# Altium project ST1-1.PrjPcb (part 2 of 5)

## Sheet User_Interface.SchDoc: User Interface
size A3; DocumentNumber: 12; SheetNumber: 13; SheetTotal: 20
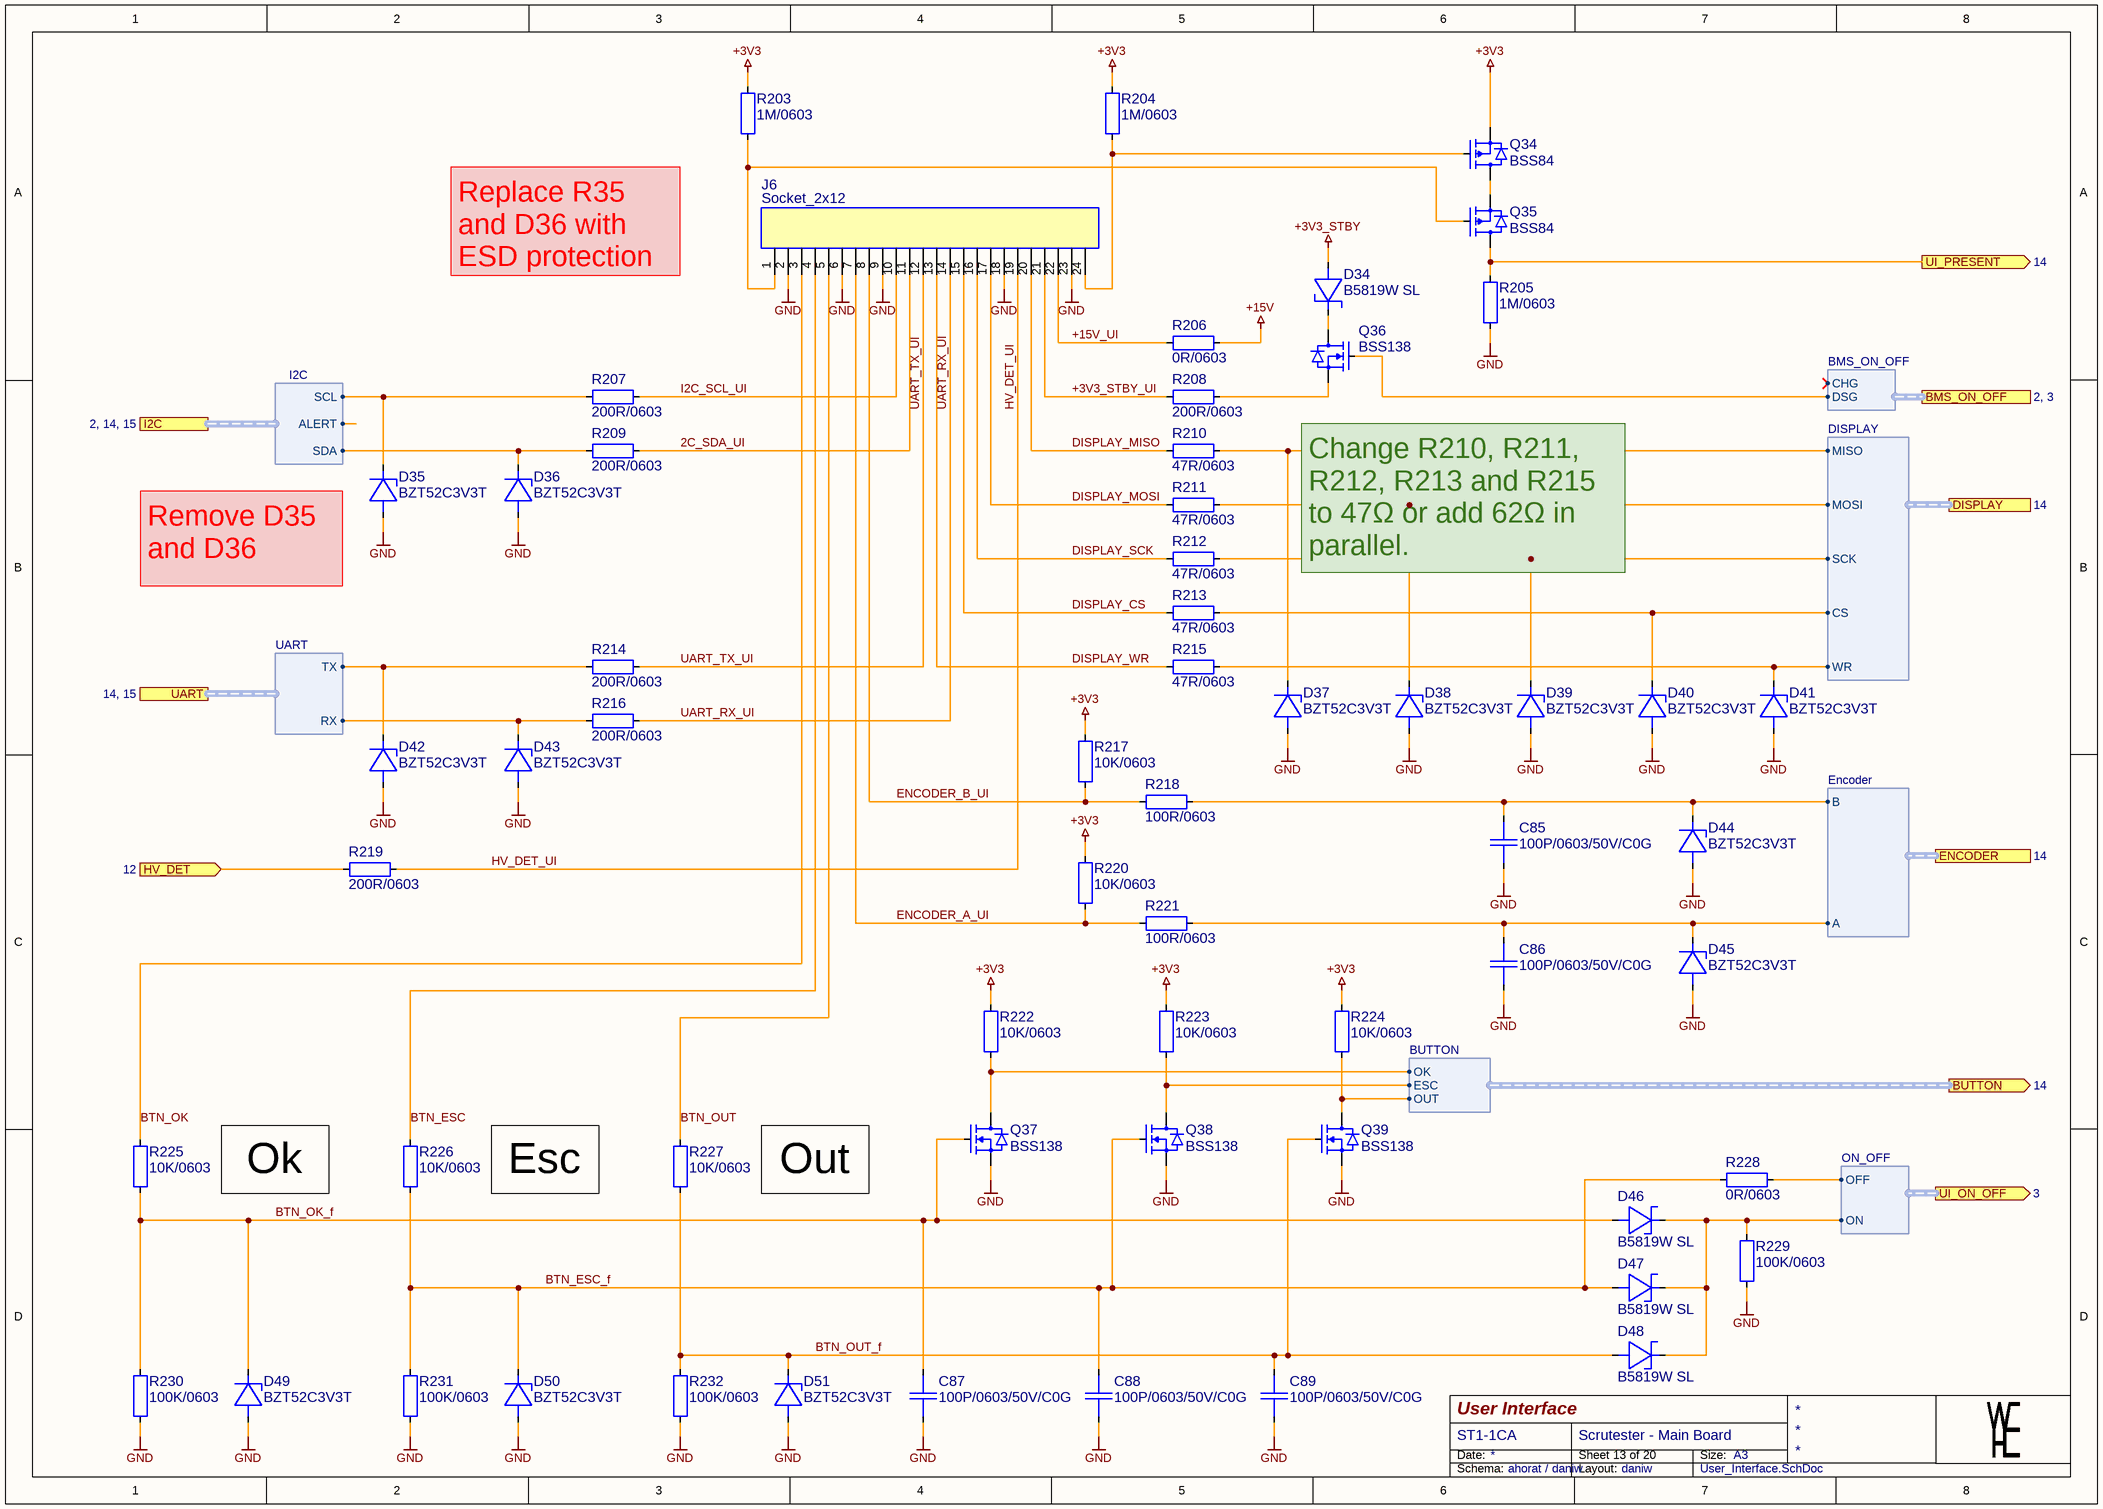
[diagram p3: User_Interface.SchDoc]

### Parts
C85  100P/0603/50V/C0G  [CAP0603_C0G]
C86  100P/0603/50V/C0G  [CAP0603_C0G]
C87  100P/0603/50V/C0G  [CAP0603_C0G]
C88  100P/0603/50V/C0G  [CAP0603_C0G]
C89  100P/0603/50V/C0G  [CAP0603_C0G]
D34  B5819W SL  [SOD3718X125]
D35  BZT52C3V3T  [SOD1608X065]
D36  BZT52C3V3T  [SOD1608X065]
D37  BZT52C3V3T  [SOD1608X065]
D38  BZT52C3V3T  [SOD1608X065]
D39  BZT52C3V3T  [SOD1608X065]
D40  BZT52C3V3T  [SOD1608X065]
D41  BZT52C3V3T  [SOD1608X065]
D42  BZT52C3V3T  [SOD1608X065]
D43  BZT52C3V3T  [SOD1608X065]
D44  BZT52C3V3T  [SOD1608X065]
D45  BZT52C3V3T  [SOD1608X065]
D46  B5819W SL  [SOD3718X125]
D47  B5819W SL  [SOD3718X125]
D48  B5819W SL  [SOD3718X125]
D49  BZT52C3V3T  [SOD1608X065]
D50  BZT52C3V3T  [SOD1608X065]
D51  BZT52C3V3T  [SOD1608X065]
J6  Socket_2x12  [SOCK_254_2X12_700]
Q34  BSS84  [SOT2395P280X125-3-SE]
Q35  BSS84  [SOT2395P280X125-3-SE]
Q36  BSS138  [SOT2395P280X125-3-SE]
Q37  BSS138  [SOT2395P280X125-3-SE]
Q38  BSS138  [SOT2395P280X125-3-SE]
Q39  BSS138  [SOT2395P280X125-3-SE]
R203  1M/0603  [R0603-0.40-WW]
R204  1M/0603  [R0603-0.40-WW]
R205  1M/0603  [R0603-0.40-WW]
R206  0R/0603  [R0603-0.40-WW]
R207  200R/0603  [R0603-0.40-WW]
R208  200R/0603  [R0603-0.40-WW]
R209  200R/0603  [R0603-0.40-WW]
R210  47R/0603  [R0603-0.40-WW]
R211  47R/0603  [R0603-0.40-WW]
R212  47R/0603  [R0603-0.40-WW]
R213  47R/0603  [R0603-0.40-WW]
R214  200R/0603  [R0603-0.40-WW]
R215  47R/0603  [R0603-0.40-WW]
R216  200R/0603  [R0603-0.40-WW]
R217  10K/0603  [R0603-0.40-WW]
R218  100R/0603  [R0603-0.40-WW]
R219  200R/0603  [R0603-0.40-WW]
R220  10K/0603  [R0603-0.40-WW]
R221  100R/0603  [R0603-0.40-WW]
R222  10K/0603  [R0603-0.40-WW]
R223  10K/0603  [R0603-0.40-WW]
R224  10K/0603  [R0603-0.40-WW]
R225  10K/0603  [R0603-0.40-WW]
R226  10K/0603  [R0603-0.40-WW]
R227  10K/0603  [R0603-0.40-WW]
R228  0R/0603  [R0603-0.40-WW]
R229  100K/0603  [R0603-0.40-WW]
R230  100K/0603  [R0603-0.40-WW]
R231  100K/0603  [R0603-0.40-WW]
R232  100K/0603  [R0603-0.40-WW]

### Ports
BMS_ON_OFF (harness BMS_ON_OFF, see 2, 3), BUTTON (out, harness BUTTON, see 14), DISPLAY (harness DISPLAY, see 14), ENCODER (harness Encoder, see 14), HV_DET (in, see 12), I2C (harness I2C, see 2, 14, 15), UART (harness UART, see 14, 15), UI_ON_OFF (out, harness ON_OFF, see 3), UI_PRESENT (out, see 14)

### Harnesses
Encoder: A, B
BUTTON: OK, ESC, OUT
I2C: ALERT, SCL, SDA
UART: TX, RX
ON_OFF: OFF, ON
DISPLAY: MISO, MOSI, SCK, CS, WR
BMS_ON_OFF: CHG, DSG

### Nets
+3V3: Q34.2(SOURCE) R203.1 R204.1 R217.1 R220.1 R222.1 R223.1 R224.1
+3V3_STBY: D34.2(A)
+15V: R206.2
GND: C85.2 C86.2 C87.2 C88.2 C89.2 D35.2(A) D36.2(A) D37.2(A) D38.2(A) D39.2(A) D40.2(A) D41.2(A) D42.2(A) D43.2(A) D44.2(A) D45.2(A) D49.2(A) D50.2(A) D51.2(A) J6.2 J6.6 J6.9 J6.18 J6.23 Q37.2(SOURCE) Q38.2(SOURCE) Q39.2(SOURCE) R205.2 R229.2 R230.2 R231.2 R232.2
2C_SDA_UI: J6.11 R209.2
+3V3_STBY_UI: J6.21 R208.2
+15V_UI: J6.22 R206.1
BMS_ON_OFF.DSG: Q36.1(GATE) ; port BMS_ON_OFF.DSG
BTN_ESC: J6.4 R226.1
BTN_ESC_f: C88.1 D47.2(A) D50.1(C) Q38.1(GATE) R226.2 R228.1 R231.1
BTN_OK: J6.3 R225.1
BTN_OK_f: C87.1 D46.2(A) D49.1(C) Q37.1(GATE) R225.2 R230.1
BTN_OUT: J6.5 R227.1
BTN_OUT_f: C89.1 D48.2(A) D51.1(C) Q39.1(GATE) R227.2 R232.1
BUTTON.ESC: Q38.3(DRAIN) R223.2 ; port BUTTON.ESC
BUTTON.OK: Q37.3(DRAIN) R222.2 ; port BUTTON.OK
BUTTON.OUT: Q39.3(DRAIN) R224.2 ; port BUTTON.OUT
DISPLAY.CS: D40.1(C) R213.2 ; port DISPLAY.CS
DISPLAY.MISO: D37.1(C) R210.2 ; port DISPLAY.MISO
DISPLAY.MOSI: D38.1(C) R211.2 ; port DISPLAY.MOSI
DISPLAY.SCK: D39.1(C) R212.2 ; port DISPLAY.SCK
DISPLAY.WR: D41.1(C) R215.2 ; port DISPLAY.WR
DISPLAY_CS: J6.15 R213.1
DISPLAY_MISO: J6.20 R210.1
DISPLAY_MOSI: J6.17 R211.1
DISPLAY_SCK: J6.16 R212.1
DISPLAY_WR: J6.13 R215.1
ENCODER.A: C86.1 D45.1(C) R221.2 ; port ENCODER.A
ENCODER.B: C85.1 D44.1(C) R218.2 ; port ENCODER.B
ENCODER_A_UI: J6.7 R220.2 R221.1
ENCODER_B_UI: J6.8 R217.2 R218.1
HV_DET: R219.1 ; port HV_DET
HV_DET_UI: J6.19 R219.2
I2C.SCL: D35.1(C) R207.1 ; port I2C.SCL
I2C.SDA: D36.1(C) R209.1 ; port I2C.SDA
I2C_SCL_UI: J6.10 R207.2
UART.RX: D43.1(C) R216.1 ; port UART.RX
UART.TX: D42.1(C) R214.1 ; port UART.TX
UART_RX_UI: J6.14 R216.2
UART_TX_UI: J6.12 R214.2
UI_ON_OFF.OFF: R228.2 ; port UI_ON_OFF.OFF
UI_ON_OFF.ON: D46.1(C) D47.1(C) D48.1(C) R229.1 ; port UI_ON_OFF.ON
UI_PRESENT: Q35.3(DRAIN) R205.1 ; port UI_PRESENT
NetD34_1: D34.1(C) Q36.3(DRAIN)
NetJ6_1: J6.1 Q35.1(GATE) R203.2
NetJ6_24: J6.24 Q34.1(GATE) R204.2
NetQ34_3: Q34.3(DRAIN) Q35.2(SOURCE)
NetQ36_2: Q36.2(SOURCE) R208.1

### Notes on the sheet
- Replace R35 and D36 with ESD protection
- (near D35) Remove D35 and D36
- Change R210, R211, R212, R213 and R215 to 47Ω or add 62Ω in parallel.
- Ok
- Esc
- Out
- Date:
- Size:
- A3
- Schema:
- Layout:

### Library data of the parts
C85-C89 = 100P/0603/50V/C0G: CAP SM 0603 100pF 50V C0G; Manufacturer: GENERIC; Manufacturer 1: YAGEO; Manufacturer Part Number 1: CC0603JRNPO9BN101; Absolute Value: 1E-10; Eurocircuits GPN: GPC0603101-C0G; Part Number: 100P/0603/50V/C0G; Package: 0603; Value: 100pF; HelpURL: https://www.yageo.com/upload/media/product/productsearch/datasheet/mlcc/UPY-GP_NP0_16V-to-50V_18.pdf; Supplier 1: Digi-Key; Supplier Part Number 1: 311-1069-1-ND; Manufacturer 2: YAGEO; Manufacturer Part Number 2: CC0603KRNPO9BN101; Supplier 2: Digi-Key; Supplier Part Number 2: 311-3600-1-ND; JLC Type: Basic; Manufacturer Part Number 3: CL10C101JB8NNNC; Supplier 3: LCSC; Supplier Part Number 3: C14858
D34 D46-D48 = B5819W SL: 40V 600mV@1A 1A SOD-123 Schottky Barrier Diodes; Manufacturer: GENERIC; Manufacturer 1: SMC Diode Solutions; Part Number: B5819W SL; Package: SOD-123; Value: B5819W SL; Absolute Value: 40V; HelpURL: https://datasheet.lcsc.com/lcsc/2304140030_Jiangsu-Changjing-Electronics-Technology-Co---Ltd--B5819W-SL_C8598.pdf; Manufacturer Part Number 1: B5819WSL; Supplier 1: Digikey; Supplier Part Number 1: 1655-B5819WSLCT-ND; Manufacturer 3: Jiangsu Changjing Electronics Technology Co., Ltd.; Manufacturer Part Number 3: B5819W SL; Supplier 3: LCSC; Supplier Part Number 3: C8598; JLC Type: Basic
D35-D45 D49-D51 = BZT52C3V3T: DIODE ZENER 3.3V 300MW SOD523; Manufacturer: Diodes Incorporated; Manufacturer Part Number 1: BZT52C3V3T-7; Part Number: BZT52C3V3T; Package: SC-79, SOD-523; Value: BZT52C3V3T; Absolute Value: 3.3 V; HelpURL: https://www.diodes.com/assets/Datasheets/ds30502.pdf; Manufacturer 1: Diodes Incorporated; Supplier 1: Digikey; Supplier Part Number 1: BZT52C3V3T-7DICT-ND; Manufacturer 2: Micro Commercial Co; Manufacturer Part Number 2: BZT52C3V3T-TP; Supplier 2: Digikey; Supplier Part Number 2: BZT52C3V3T-TPMSCT-ND; Manufacturer 3: BORN; Manufacturer Part Number 3: BZT52C3V3T; Supplier 3: LCSC; Supplier Part Number 3: C20612286
J6 = Socket_2x12_7mm: Socket 2.100mil 2x12, height 7mm; Manufacturer: GENERIC; Manufacturer 1: Preci-Dip; Manufacturer Part Number 1: 803-87-024-10-001101; System: Connector; Part Number: Socket_2x12_7mm; Supplier 1: Digi-Key; Supplier Part Number 1: 1212-1252-ND
Q34 Q35 = BSS84: 50V P-Channel MOSFET; Manufacturer: GENERIC; Manufacturer 1: Good-Ark Semiconductor; Part Number: BSS84; Package: SOT23; HelpURL: https://goodarksemi.com/docs/datasheets/mosfets/BSS84.pdf; Manufacturer Part Number 1: BSS84; Supplier 1: Digi-Key; Supplier Part Number 1: 4786-BSS84CT-ND; Manufacturer 3: Jiangsu Changjing Electronics Technology Co., Ltd.; Manufacturer Part Number 3: BSS84; Supplier 3: LCSC; Supplier Part Number 3: C114481; JLC Type: Extended; Manufacturer 2: LRC; Manufacturer Part Number 2: LBSS84LT1G; Supplier 2: LCSC; Supplier Part Number 2: C8492
Q36-Q39 = BSS138: N-Kanal 50 V 220mA (Ta) 350mW (Ta) Oberflächenmontage SOT-23; Manufacturer: GENERIC; Manufacturer 1: ANBON SEMICONDUCTOR (INT'L) LIMITED; Part Number: BSS138; Package: SOT23; HelpURL: https://mm.digikey.com/Volume0/opasdata/d220001/medias/docus/3037/BSS138.pdf; Manufacturer Part Number 1: BSS138; Supplier 1: Digi-Key; Supplier Part Number 1: 4530-BSS138CT-ND; Manufacturer 3: FOSAN; Manufacturer Part Number 3: BSS138; Supplier 3: LCSC; Supplier Part Number 3: C2926186; JLC Type: Extended; Manufacturer 2: FOSAN; Manufacturer Part Number 2: BSS138; Supplier 2: LCSC; Supplier Part Number 2: C2926186
R203-R205 = 1M/0603: RES SM 0603 1M; Manufacturer: GENERIC; Manufacturer 1: YAGEO; Manufacturer Part Number 1: RC0603FR-131ML; Absolute Value: 1000000; Eurocircuits GPN: GPR06031M; Part Number: 1M/0603; Package: 0603; Value: 1M; HelpURL: https://www.yageogroup.com/content/datasheet/asset/file/PYU-RC_GROUP_51_ROHS_L; Supplier 1: Digi-Key; Supplier Part Number 1: 13-RC0603FR-131MLCT-ND; Manufacturer 2: YAGEO; Manufacturer Part Number 2: RC0603FR-101ML; Supplier 2: Digi-Key; Supplier Part Number 2: 13-RC0603FR-101MLCT-ND; Manufacturer 3: UNI-ROYAL(Uniroyal Elec); Manufacturer Part Number 3: 0603WAF1004T5E; Supplier 3: LCSC; Supplier Part Number 3: C22935; JLC Type: Basic
R206 R228 = 0R/0603: RES SM 0603 0R; Manufacturer: GENERIC; Manufacturer 1: YAGEO; Manufacturer Part Number 1: RC0603FR-070RL; Absolute Value: 0; Eurocircuits GPN: GPR06030R; Part Number: 0R/0603; Package: 0603; Value: 0R; HelpURL: https://www.yageogroup.com/content/datasheet/asset/file/PYU-RC_GROUP_51_ROHS_L; Supplier 1: Digi-Key; Supplier Part Number 1: 311-0.0HRCT-ND; Manufacturer 2: YAGEO; Manufacturer Part Number 2: RC0603FR-130RL; Supplier 2: Digi-Key; Supplier Part Number 2: 13-RC0603FR-130RLCT-ND; Manufacturer 3: UNI-ROYAL(Uniroyal Elec); Manufacturer Part Number 3: 0603WAF0000T5E; Supplier 3: LCSC; Supplier Part Number 3: C21189; JLC Type: Basic
R207-R209 R214 R216 R219 = 200R/0603: RES SM 0603 200R; Manufacturer: GENERIC; Manufacturer 1: YAGEO; Manufacturer Part Number 1: RC0603FR-13200RL; Absolute Value: 200; Eurocircuits GPN: GPR0603200R; Part Number: 200R/0603; Package: 0603; Value: 200R; HelpURL: https://www.yageogroup.com/content/datasheet/asset/file/PYU-RC_GROUP_51_ROHS_L; Supplier 1: Digi-Key; Supplier Part Number 1: 13-RC0603FR-13200RLCT-ND; Manufacturer 2: YAGEO; Manufacturer Part Number 2: RC0603FR-07200RL; Supplier 2: Digi-Key; Supplier Part Number 2: 311-200HRCT-ND; JLC Type: Basic; Manufacturer 3: UNI-ROYAL(Uniroyal Elec); Manufacturer Part Number 3: 0603WAF2000T5E; Supplier 3: LCSC; Supplier Part Number 3: C8218
R210-R213 R215 = 47R/0603: RES SM 0603 47R; Manufacturer: GENERIC; Manufacturer 1: YAGEO; Manufacturer Part Number 1: RC0603FR-1347RL; Absolute Value: 47; Eurocircuits GPN: GPR060347R; Part Number: 47R/0603; Package: 0603; Value: 47R; HelpURL: https://www.yageogroup.com/content/datasheet/asset/file/PYU-RC_GROUP_51_ROHS_L; Supplier 1: Digi-Key; Supplier Part Number 1: 13-RC0603FR-1347RLCT-ND; Manufacturer 2: YAGEO; Manufacturer Part Number 2: RC0603FR-1047RL; Supplier 2: Digi-Key; Supplier Part Number 2: 13-RC0603FR-1047RLCT-ND
R217 R220 R222-R227 = 10K/0603: RES SM 0603 10K; Manufacturer: GENERIC; Manufacturer 1: YAGEO; Manufacturer Part Number 1: RC0603FR-1310KL; Absolute Value: 10000; Eurocircuits GPN: GPR060310K; Part Number: 10K/0603; Package: 0603; Value: 10K; HelpURL: https://www.yageogroup.com/content/datasheet/asset/file/PYU-RC_GROUP_51_ROHS_L; Supplier 1: Digi-Key; Supplier Part Number 1: 13-RC0603FR-1310KLCT-ND; Manufacturer 2: YAGEO; Manufacturer Part Number 2: RC0603FR-1010KL; Supplier 2: Digi-Key; Supplier Part Number 2: 13-RC0603FR-1010KLCT-ND; Manufacturer 3: UNI-ROYAL(Uniroyal Elec); Manufacturer Part Number 3: 0603WAF1002T5E; Supplier 3: LCSC; Supplier Part Number 3: C25804; JLC Type: Basic
R218 R221 = 100R/0603: RES SM 0603 100R; Manufacturer: GENERIC; Manufacturer 1: YAGEO; Manufacturer Part Number 1: RC0603FR-13100RL; Absolute Value: 100; Eurocircuits GPN: GPR0603100R; Part Number: 100R/0603; Package: 0603; Value: 100R; HelpURL: https://www.yageogroup.com/content/datasheet/asset/file/PYU-RC_GROUP_51_ROHS_L; Supplier 1: Digi-Key; Supplier Part Number 1: 13-RC0603FR-13100RLCT-ND; Manufacturer 2: YAGEO; Manufacturer Part Number 2: RC0603FR-10100RL; Supplier 2: Digi-Key; Supplier Part Number 2: 13-RC0603FR-10100RLCT-ND; Manufacturer 3: UNI-ROYAL(Uniroyal Elec); Manufacturer Part Number 3: 0603WAF1000T5E; Supplier 3: LCSC; Supplier Part Number 3: C22775
R229-R232 = 100K/0603: RES SM 0603 100K; Manufacturer: GENERIC; Manufacturer 1: YAGEO; Manufacturer Part Number 1: RC0603FR-13100KL; Absolute Value: 100000; Eurocircuits GPN: GPR0603100K; Part Number: 100K/0603; Package: 0603; Value: 100K; HelpURL: https://www.yageogroup.com/content/datasheet/asset/file/PYU-RC_GROUP_51_ROHS_L; Supplier 1: Digi-Key; Supplier Part Number 1: 13-RC0603FR-13100KLCT-ND; Manufacturer 2: YAGEO; Manufacturer Part Number 2: RC0603FR-10100KL; Supplier 2: Digi-Key; Supplier Part Number 2: 13-RC0603FR-10100KLCT-ND; Manufacturer 3: UNI-ROYAL(Uniroyal Elec); Manufacturer Part Number 3: 0603WAF1003T5E; Supplier 3: LCSC; Supplier Part Number 3: C25803; JLC Type: Basic

## Sheet Converter.SchDoc: Converter
size A3; DocumentNumber: 4; SheetNumber: 4; SheetTotal: 20
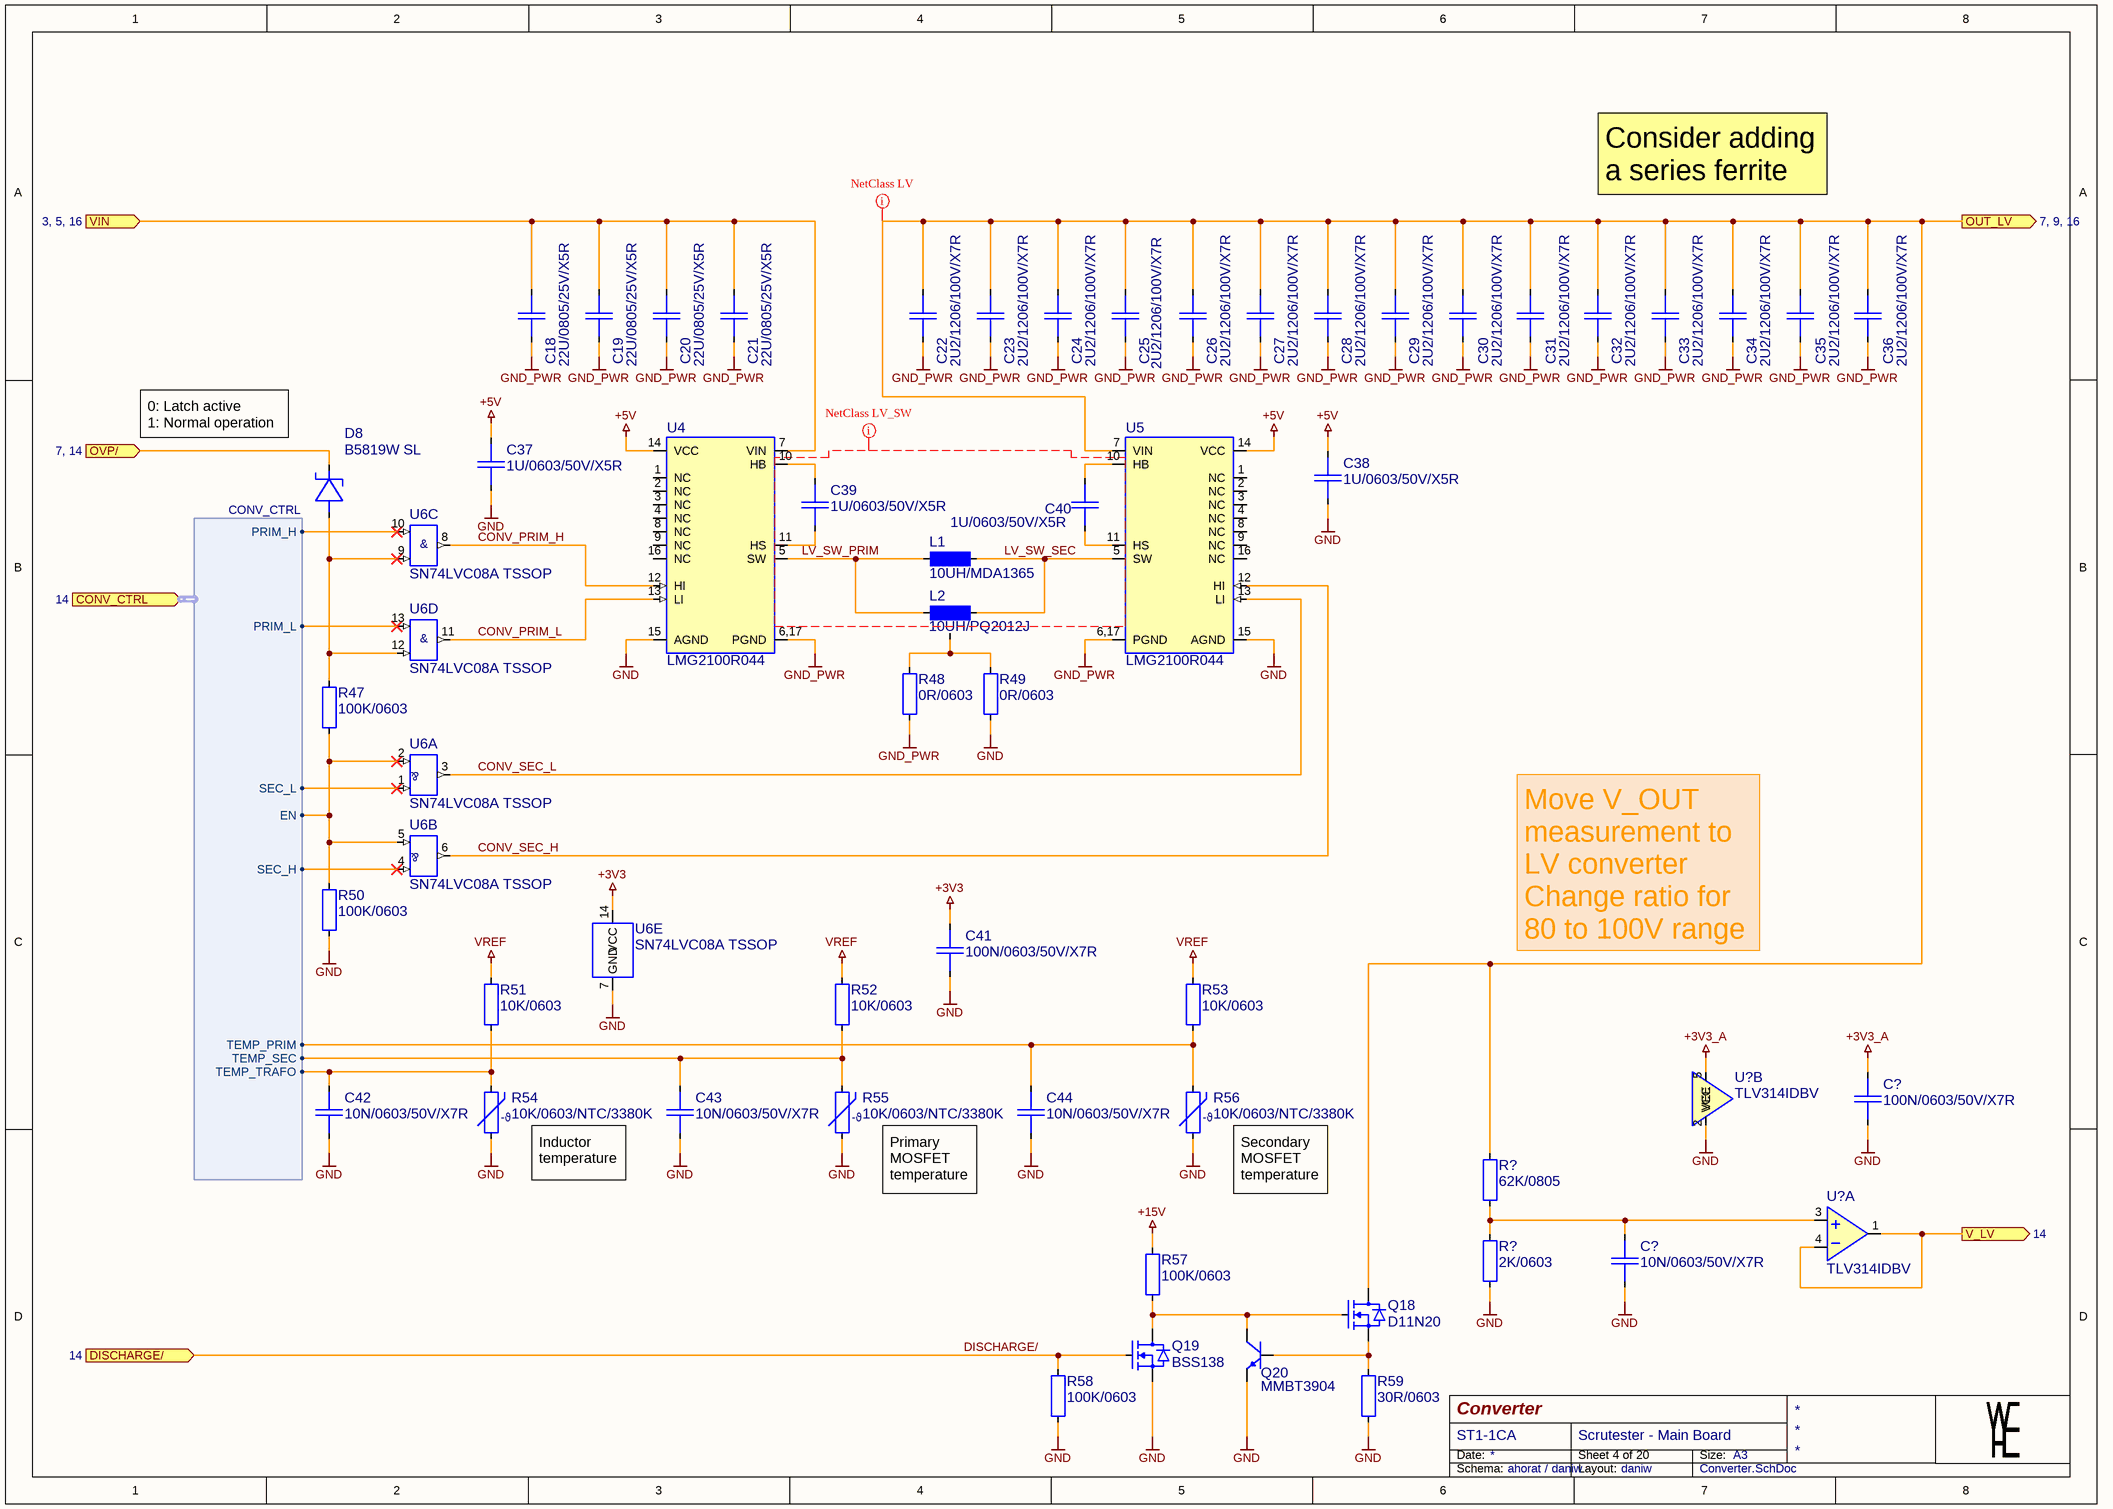
[diagram p4: Converter.SchDoc]

### Parts
(Parts that share a designator on the sheet are numbered #1, #2 ... from top to bottom, then left to right.)
C18  22U/0805/25V/X5R  [CAP0805_X7R]
C19  22U/0805/25V/X5R  [CAP0805_X7R]
C20  22U/0805/25V/X5R  [CAP0805_X7R]
C21  22U/0805/25V/X5R  [CAP0805_X7R]
C22  2U2/1206/100V/X7R  [CAP1206-X7R]
C23  2U2/1206/100V/X7R  [CAP1206-X7R]
C24  2U2/1206/100V/X7R  [CAP1206-X7R]
C25  2U2/1206/100V/X7R  [CAP1206-X7R]
C26  2U2/1206/100V/X7R  [CAP1206-X7R]
C27  2U2/1206/100V/X7R  [CAP1206-X7R]
C28  2U2/1206/100V/X7R  [CAP1206-X7R]
C29  2U2/1206/100V/X7R  [CAP1206-X7R]
C30  2U2/1206/100V/X7R  [CAP1206-X7R]
C31  2U2/1206/100V/X7R  [CAP1206-X7R]
C32  2U2/1206/100V/X7R  [CAP1206-X7R]
C33  2U2/1206/100V/X7R  [CAP1206-X7R]
C34  2U2/1206/100V/X7R  [CAP1206-X7R]
C35  2U2/1206/100V/X7R  [CAP1206-X7R]
C36  2U2/1206/100V/X7R  [CAP1206-X7R]
C37  1U/0603/50V/X5R  [CAP0603_X7R]
C38  1U/0603/50V/X5R  [CAP0603_X7R]
C39  1U/0603/50V/X5R  [CAP0603_X7R]
C40  1U/0603/50V/X5R  [CAP0603_X7R]
C41  100N/0603/50V/X7R  [CAP0603_X7R]
C42  10N/0603/50V/X7R  [CAP0603_X7R]
C43  10N/0603/50V/X7R  [CAP0603_X7R]
C44  10N/0603/50V/X7R  [CAP0603_X7R]
C?#1  100N/0603/50V/X7R  [CAP0603_X7R]
C?#2  10N/0603/50V/X7R  [CAP0603_X7R]
D8  B5819W SL  [SOD3718X125]
L1  10UH/MDA1365  [INDM140X128X65]
L2  10UH/PQ2012J  [IND_PQ2015J]
Q18  D11N20  [TO228P990X229-3]
Q19  BSS138  [SOT2395P280X125-3-SE]
Q20  MMBT3904  [SOT2395P280X125-3-SE]
R47  100K/0603  [R0603-0.40-WW]
R48  0R/0603  [R0603-0.40-WW]
R49  0R/0603  [R0603-0.40-WW]
R50  100K/0603  [R0603-0.40-WW]
R51  10K/0603  [R0603-0.40-WW]
R52  10K/0603  [R0603-0.40-WW]
R53  10K/0603  [R0603-0.40-WW]
R54  10K/0603/NTC/3380K  [R0603-0.40-WW]
R55  10K/0603/NTC/3380K  [R0603-0.40-WW]
R56  10K/0603/NTC/3380K  [R0603-0.40-WW]
R57  100K/0603  [R0603-0.40-WW]
R58  100K/0603  [R0603-0.40-WW]
R59  30R/0603  [R0603-0.40-WW]
R?#1  62K/0805  [R0805-0.50-WW]
R?#2  2K/0603  [R0603-0.40-WW]
U4  LMG2100R044  [QFN050P450X550X085-16-TI-VQFN-FCRLF]
U5  LMG2100R044  [QFN050P450X550X085-16-TI-VQFN-FCRLF]
U6  SN74LVC08A TSSOP  [SOP065P640X120-14NW]  (parts A,B,C,D,E of 5)
U?#1  TLV314IDBV  [SOT2395P280X125-5-NW]  (part B of 2)
U?#2  TLV314IDBV  [SOT2395P280X125-5-NW]  (part A of 2)

### Ports
CONV_CTRL (in, harness CONV_CTRL, see 14), DISCHARGE/ (in, see 14), OUT_LV (out, see 7, 9, 16), OVP/ (in, see 7, 14), V_LV (out, see 14), VIN (in, see 3, 5, 16)

### Harnesses
CONV_CTRL: EN, PRIM_L, SEC_L, PRIM_H, TEMP_PRIM, TEMP_SEC, TEMP_TRAFO, SEC_H

### Nets
+3V3: C41.1 U6.14(VCC)
+3V3_A: C?#1.1 U?#1.5(VCC)
+5V: C37.1 C38.1 U4.14(VCC) U5.14(VCC)
+15V: R57.1
GND: C37.2 C38.2 C41.2 C42.2 C43.2 C44.2 C?#1.2 C?#2.2 Q19.2(SOURCE) Q20.2(EMITTER) R49.2 R50.2 R54.2 R55.2 R56.2 R58.2 R59.2 R?#2.2 U4.15(AGND) U5.15(AGND) U6.7(GND) U?#1.2(VEE)
GND_PWR: C18.2 C19.2 C20.2 C21.2 C22.2 C23.2 C24.2 C25.2 C26.2 C27.2 C28.2 C29.2 C30.2 C31.2 C32.2 C33.2 C34.2 C35.2 C36.2 R48.2 U4.6,17(PGND) U5.6,17(PGND)
VREF: R51.1 R52.1 R53.1
CONV_CTRL.EN: R47.1 R50.1 U6.2(B0) U6.5(B1) ; port CONV_CTRL.EN
CONV_CTRL.PRIM_H: U6.10(A2) ; port CONV_CTRL.PRIM_H
CONV_CTRL.PRIM_L: U6.13(A3) ; port CONV_CTRL.PRIM_L
CONV_CTRL.SEC_H: U6.4(A1) ; port CONV_CTRL.SEC_H
CONV_CTRL.SEC_L: U6.1(A0) ; port CONV_CTRL.SEC_L
CONV_CTRL.TEMP_PRIM: C44.1 R53.2 R56.1 ; port CONV_CTRL.TEMP_PRIM
CONV_CTRL.TEMP_SEC: C43.1 R52.2 R55.1 ; port CONV_CTRL.TEMP_SEC
CONV_CTRL.TEMP_TRAFO: C42.1 R51.2 R54.1 ; port CONV_CTRL.TEMP_TRAFO
CONV_PRIM_H: U4.12(HI) U6.8(Y2)
CONV_PRIM_L: U4.13(LI) U6.11(Y3)
CONV_SEC_H: U5.12(HI) U6.6(Y1)
CONV_SEC_L: U5.13(LI) U6.3(Y0)
DISCHARGE/: Q19.1(GATE) R58.1 ; port DISCHARGE/
LV_SW_PRIM: L1.1 L2.1 U4.5(SW)
LV_SW_SEC: L1.2 L2.2 U5.5(SW)
OUT_LV: C22.1 C23.1 C24.1 C25.1 C26.1 C27.1 C28.1 C29.1 C30.1 C31.1 C32.1 C33.1 C34.1 C35.1 C36.1 Q18.3(DRAIN) R?#1.1 U5.7(VIN) ; port OUT_LV
OVP/: D8.1(C) ; port OVP/
V_LV: U?#2.1(OUT) U?#2.4(IN-) ; port V_LV
VIN: C18.1 C19.1 C20.1 C21.1 U4.7(VIN) ; port VIN
NetC39_1: C39.1 U4.10(HB)
NetC39_2: C39.2 U4.11(HS)
NetC40_1: C40.1 U5.10(HB)
NetC40_2: C40.2 U5.11(HS)
NetC?#2_1: C?#2.1 R?#1.2 R?#2.1 U?#2.3(IN+)
NetD8_2: D8.2(A) R47.2 U6.9(B2) U6.12(B3)
NetL2_3: L2.3 R48.1 R49.1
NetQ18_1: Q18.1(GATE) Q19.3(DRAIN) Q20.3(COLLECTOR) R57.2
NetQ18_2: Q18.2(SOURCE) Q20.1(BASE) R59.1

Not connected (* = marked no-connect by the designer): U4 1(NC) 2(NC) 3(NC) 4(NC) 8(NC) 9(NC) 16(NC); U5 1(NC) 2(NC) 3(NC) 4(NC) 8(NC) 9(NC) 16(NC)

### Layout directives
net class LV: OUT_LV
net class LV_SW: LV_SW_PRIM, LV_SW_SEC

### Notes on the sheet
- Consider adding a series ferrite
- (near D8) 0: Latch active
  1: Normal operation
- Move V_OUT measurement to LV converter
  Change ratio for 80 to 100V range
- Inductor temperature
- Primary MOSFET temperature
- (near R56) Secondary MOSFET temperature
- (near R56) Alternative:
  G830K (C22362804)
- Date:
- Size:
- A3
- Schema:
- Layout:
- (in symbol 10K/0603/NTC/3380K) -ϑ
- (in symbol SN74LVC08A TSSOP, part A) &
- (in symbol SN74LVC08A TSSOP, part B) &
- (in symbol SN74LVC08A TSSOP, part C) &
- (in symbol SN74LVC08A TSSOP, part D) &

### Library data of the parts
C18-C21 = 22U/0805/25V/X5R: CAP SM 0805 22uF 25V X5R; Manufacturer: GENERIC; Manufacturer 1: Samsung Electro-Mechanics; Manufacturer Part Number 1: CL21A226MAYNNNE; Absolute Value: 2.2E-5; Eurocircuits GPN: GPN0805106-25; Part Number: 22U/0805/25V/X5R; Package: 0805; Value: 22uF; HelpURL: https://mm.digikey.com/Volume0/opasdata/d220001/medias/docus/339/CL21A226MAYNNNE_Spec.pdf; Supplier 1: Digi-Key; Supplier Part Number 1: 1276-CL21A226MAYNNNECT-ND; Manufacturer Part Number 3: CL21A226MAQNNNE; Supplier 3: LCSC; Supplier Part Number 3: C45783; JLC Type: Basic
C22-C36 = 2U2/1206/100V/X7R: CAP SM 1206 2.2uF 100V X7R; Manufacturer: GENERIC; Manufacturer 1: YAGEO; Manufacturer Part Number 1: CC1206KKX7R0BB225; Absolute Value: 2.2E-6; Part Number: 2U2/1206/100V/X7R; Package: 1206; Value: 2.2uF; HelpURL: https://www.yageogroup.com/content/datasheet/asset/file/UPY-GPHC_X7R_6_3V-TO-250V; Supplier 1: Digi-Key; Supplier Part Number 1: 311-3450-1-ND; Manufacturer Part Number 3: CC1206KKX7R0BB225; Supplier 3: LCSC; Supplier Part Number 3: C577211; JLC Type: Extended
C37-C40 = 1U/0603/50V/X5R: CAP SM 0603 1.0uF 50V X5R; Manufacturer: GENERIC; Manufacturer 1: Samsung Electro-Mechanics; Manufacturer Part Number 1: CL10A105KB8NNNC; Absolute Value: 1E-6; Eurocircuits GPN: GPC0603105-X5R; Part Number: 1U/0603/50V/X5R; Package: 0603; Value: 1.0uF; HelpURL: https://mm.digikey.com/Volume0/opasdata/d220001/medias/docus/658/CL10A105KB8NNNC_Spec.pdf; Supplier 1: Digi-Key; Supplier Part Number 1: 1276-1860-1-ND; Supplier 3: LCSC; Supplier Part Number 3: C15849; JLC Type: Basic; Manufacturer Part Number 3: CL10A105KB8NNNC
C41 C?#1 = 100N/0603/50V/X7R: CAP SM 0603 100nF 50V X7R; Manufacturer: GENERIC; Manufacturer 1: YAGEO; Manufacturer Part Number 1: CC0603KPX7R9BB104; Absolute Value: 1E-7; Eurocircuits GPN: GPC0603104; Part Number: 100N/0603/50V/X7R; Package: 0603; Value: 100nF; HelpURL: https://www.yageo.com/upload/media/product/app/datasheet/mlcc/upy-gphc_x7r_6_3v-to-250v.pdf; Supplier 1: Digi-Key; Supplier Part Number 1: 311-3567-1-ND; Supplier 3: LCSC; Supplier Part Number 3: C14663; Manufacturer 2: YAGEO; Manufacturer Part Number 2: CC0603MRX7R9BB104; Supplier 2: Digi-Key; Supplier Part Number 2: 311-4110-1-ND; JLC Type: Basic; Manufacturer Part Number 3: CC0603KRX7R9BB104
C42-C44 C?#2 = 10N/0603/50V/X7R: CAP SM 0603 10nF 50V X7R; Manufacturer: GENERIC; Manufacturer 1: YAGEO; Manufacturer Part Number 1: CC0603KPX7R9BB103; Absolute Value: 1E-8; Eurocircuits GPN: GPC0603103; Part Number: 10N/0603/50V/X7R; Package: 0603; Value: 10nF; HelpURL: https://www.yageo.com/upload/media/product/app/datasheet/mlcc/upy-gphc_x7r_6_3v-to-250v.pdf; Supplier 1: Digi-Key; Supplier Part Number 1: 311-1572-1-ND; Manufacturer 2: YAGEO; Manufacturer Part Number 2: CC0603KRX7R9BB103; Supplier 2: Digi-Key; Supplier Part Number 2: 311-1085-1-ND; Manufacturer Part Number 3: CC0603KRX7R9BB103; Supplier 3: LCSC; Supplier Part Number 3: C100042
D8 = B5819W SL: as D34 on sheet User_Interface; Part Number: B5819W SL; Package: SOD-123; Value: B5819W SL; Absolute Value: 40V; HelpURL: https://datasheet.lcsc.com/lcsc/2304140030_Jiangsu-Changjing-Electronics-Technology-Co---Ltd--B5819W-SL_C8598.pdf; Manufacturer Part Number 1: B5819WSL; Supplier 1: Digikey; Supplier Part Number 1: 1655-B5819WSLCT-ND; Manufacturer 3: Jiangsu Changjing Electronics Technology Co., Ltd.; Manufacturer Part Number 3: B5819W SL; Supplier 3: LCSC; Supplier Part Number 3: C8598; JLC Type: Basic
L1 = 10UH/MDA1365: Fixed Ind 10uH 11A 15.8mOhm SMD MDA1365; Manufacturer: Koherelec; Absolute Value: 1E-5; Part Number: 10UH/MDA1365; Package: 1365; Value: 10UH; HelpURL: http://www.kohergroup.com/template/default/pdf/MDA1365.pdf; Manufacturer 3: KOHERelec; Manufacturer Part Number 3: MDA1365-100M; Supplier 3: LCSC; Supplier Part Number 3: C2847583; JLC Type: Extended
L2 = 10UH/PQ2012J: Fixed Ind 10uH 14A 4.8mOhm SMD; Manufacturer: XR; Absolute Value: 1E-5; Part Number: 10UH/PQ2012J; Package: PQ2012J; Value: 10UH; HelpURL: https://www.lcsc.com/datasheet/C48391639.pdf; Manufacturer 3: XR; Manufacturer Part Number 3: XRPQ2012J-100M; Supplier 3: LCSC; Supplier Part Number 3: C48391639; JLC Type: Extended
Q18 = D11N20: N-Channel MOSFET 200V 11A; Manufacturer: Jingdao Microelectronics; Part Number: D11N20; Package: TO-252AA; HelpURL: https://www.lcsc.com/datasheet/C2935478.pdf; Manufacturer 3: Jingdao Microelectronics; Manufacturer Part Number 3: D11N20; Supplier 3: LCSC; Supplier Part Number 3: C2935478; JLC Type: Extended
Q19 = BSS138: as Q36 on sheet User_Interface; Part Number: BSS138; Package: SOT23; HelpURL: https://mm.digikey.com/Volume0/opasdata/d220001/medias/docus/3037/BSS138.pdf; Manufacturer Part Number 1: BSS138; Supplier 1: Digi-Key; Supplier Part Number 1: 4530-BSS138CT-ND; Manufacturer 3: FOSAN; Manufacturer Part Number 3: BSS138; Supplier 3: LCSC; Supplier Part Number 3: C2926186; JLC Type: Extended; Manufacturer 2: FOSAN; Manufacturer Part Number 2: BSS138; Supplier 2: LCSC; Supplier Part Number 2: C2926186
Q20 = MMBT3904: MMBT3904 40V, 0.2A NPN BJT transistor; Manufacturer: GENERIC; Manufacturer 1: onsemi; Manufacturer Part Number 1: MMBT3904LT1G; Part Number: MMBT3904; Package: SOT23; HelpURL: https://onsemi.com/pdf/datasheet/mmbt3904lt1-d.pdf; Manufacturer 3: JSCJ; Manufacturer Part Number 3: MMBT3904(RANGE:100-300); Supplier 3: LCSC; Supplier Part Number 3: C20526; Supplier 1: Digi-Key; Supplier Part Number 1: MMBT3904LT1GOSCT-ND; Manufacturer 2: MCC (Micro Commercial Components); Manufacturer Part Number 2: MMBT3904-TP; Supplier 2: Digikey; Supplier Part Number 2: MMBT3904TPMSCT-ND; JLC Type: Basic
R47 R50 R57 R58 = 100K/0603: as R229 on sheet User_Interface; Part Number: 100K/0603; Package: 0603; Value: 100K; HelpURL: https://www.yageogroup.com/content/datasheet/asset/file/PYU-RC_GROUP_51_ROHS_L; Supplier 1: Digi-Key; Supplier Part Number 1: 13-RC0603FR-13100KLCT-ND; Manufacturer 2: YAGEO; Manufacturer Part Number 2: RC0603FR-10100KL; Supplier 2: Digi-Key; Supplier Part Number 2: 13-RC0603FR-10100KLCT-ND; Manufacturer 3: UNI-ROYAL(Uniroyal Elec); Manufacturer Part Number 3: 0603WAF1003T5E; Supplier 3: LCSC; Supplier Part Number 3: C25803; JLC Type: Basic
R48 R49 = 0R/0603: as R206 on sheet User_Interface; Part Number: 0R/0603; Package: 0603; Value: 0R; HelpURL: https://www.yageogroup.com/content/datasheet/asset/file/PYU-RC_GROUP_51_ROHS_L; Supplier 1: Digi-Key; Supplier Part Number 1: 311-0.0HRCT-ND; Manufacturer 2: YAGEO; Manufacturer Part Number 2: RC0603FR-130RL; Supplier 2: Digi-Key; Supplier Part Number 2: 13-RC0603FR-130RLCT-ND; Manufacturer 3: UNI-ROYAL(Uniroyal Elec); Manufacturer Part Number 3: 0603WAF0000T5E; Supplier 3: LCSC; Supplier Part Number 3: C21189; JLC Type: Basic
R51-R53 = 10K/0603: as R217 on sheet User_Interface; Part Number: 10K/0603; Package: 0603; Value: 10K; HelpURL: https://www.yageogroup.com/content/datasheet/asset/file/PYU-RC_GROUP_51_ROHS_L; Supplier 1: Digi-Key; Supplier Part Number 1: 13-RC0603FR-1310KLCT-ND; Manufacturer 2: YAGEO; Manufacturer Part Number 2: RC0603FR-1010KL; Supplier 2: Digi-Key; Supplier Part Number 2: 13-RC0603FR-1010KLCT-ND; Manufacturer 3: UNI-ROYAL(Uniroyal Elec); Manufacturer Part Number 3: 0603WAF1002T5E; Supplier 3: LCSC; Supplier Part Number 3: C25804; JLC Type: Basic
R54-R56 = 10K/0603/NTC/3380K: RES NTC SM 0603 10K; Manufacturer: GENERIC; Manufacturer 1: Murata; Manufacturer Part Number 1: NCU18XH103E60RB; Absolute Value: 10000; Eurocircuits GPN: GPR060310K; Part Number: 10K/0603/NTC/3380K; Package: 0603; Value: 10K; HelpURL: https://www.murata.com/en-us/api/pdfdownloadapi?cate=luNTCforTempeSenso&partno=NCU18XH103E60RB; Supplier 1: Digi-Key; Supplier Part Number 1: 490-18164-1-ND; Manufacturer 3: Sunlord; Manufacturer Part Number 3: SDNT1608X103F3380FTF; Supplier 3: LCSC; Supplier Part Number 3: C316397; JLC Type: Extended
R59 = 30R/0603: RES SM 0603 30R; Manufacturer: GENERIC; Manufacturer 1: YAGEO; Manufacturer Part Number 1: RC0603FR-1330RL; Absolute Value: 30; Eurocircuits GPN: GPR060330R; Part Number: 30R/0603; Package: 0603; Value: 30R; HelpURL: https://www.yageogroup.com/content/datasheet/asset/file/PYU-RC_GROUP_51_ROHS_L; Supplier 1: Digi-Key; Supplier Part Number 1: 13-RC0603FR-1330RLCT-ND; Manufacturer 2: YAGEO; Manufacturer Part Number 2: RC0603FR-0730RL; Supplier 2: Digi-Key; Supplier Part Number 2: 311-30.0HRCT-ND; JLC Type: Extended; Manufacturer 3: YAGEO; Manufacturer Part Number 3: RC0603FR-0730RL; Supplier 3: LCSC; Supplier Part Number 3: C128060
R?#1 = 62K/0805: RES SM 0805 62K; Manufacturer: GENERIC; Manufacturer 1: YAGEO; Manufacturer Part Number 1: RC0805FR-0762KL; Absolute Value: 62000; Eurocircuits GPN: GPR080562K; Part Number: 62K/0805; Package: 0805; Value: 62K; HelpURL: https://www.yageogroup.com/content/datasheet/asset/file/PYU-RC_GROUP_51_ROHS_L; Supplier 1: Digi-Key; Supplier Part Number 1: 311-62.0KCRCT-ND
R?#2 = 2K/0603: RES SM 0603 2K; Manufacturer: GENERIC; Manufacturer 1: YAGEO; Manufacturer Part Number 1: RC0603FR-132KL; Absolute Value: 2000; Eurocircuits GPN: GPR06032K; Part Number: 2K/0603; Package: 0603; Value: 2K; HelpURL: https://www.yageogroup.com/content/datasheet/asset/file/PYU-RC_GROUP_51_ROHS_L; Supplier 1: Digi-Key; Supplier Part Number 1: 13-RC0603FR-132KLCT-ND; JLC Type: Basic; Manufacturer 3: UNI-ROYAL(Uniroyal Elec); Manufacturer Part Number 3: 0603WAF2001T5E; Supplier 3: LCSC; Supplier Part Number 3: C22975; Manufacturer 2: YAGEO; Manufacturer Part Number 2: RC0603FR-102KL; Supplier 2: Digi-Key; Supplier Part Number 2: 13-RC0603FR-102KLCT-ND
U4 U5 = LMG2100R044: LMG2100R044 100V, 35A GaN Half-Bridge Power Stage; Manufacturer: Texas Instruments; Manufacturer Part Number 1: LMG2100R044RARR; Part Number: LMG2100R044; Package: QFN-17; HelpURL: https://www.ti.com/lit/ds/symlink/lmg2100r044.pdf; Manufacturer 1: Texas Instruments; Supplier 1: Digi-Key; Supplier Part Number 1: 296-LMG2100R044RARRCT-ND; Manufacturer 3: TI; Manufacturer Part Number 3: LMG2100R044RARR; Supplier 3: LCSC; Supplier Part Number 3: C22453052; JLC Type: Extended
U6 = SN74LVC08A TSSOP: SN74LVC08A Quadruple 2-Input Positive-AND Gates; Manufacturer: TI; Manufacturer 1: Texas Instruments; Manufacturer Part Number 1: SN74LVC08APWR; Part Number: SN74LVC08A TSSOP; Package: TSSOP; Manufacturer 3: TI; Manufacturer Part Number 3: SN74LVC08APWR; Supplier 3: LCSC; Supplier Part Number 3: C465737; JLC Type: Extended; HelpURL: https://www.ti.com/lit/ds/symlink/sn74lvc08a.pdf; Supplier 1: Digi-Key; Supplier Part Number 1: 296-1221-1-ND
U?#1 U?#2 = TLV314 SOT23: TLV314, 3-MHz, Low-Power, Internal EMI Filter, RRIO, Operational Amplifier; Manufacturer: Texas Instruments; Manufacturer Part Number 1: TLV314IDBVR; Part Number: TLV314 SOT23; Package: SOT23-5; HelpURL: https://www.ti.com/lit/ds/symlink/tlv4314.pdf; Manufacturer 1: Texas Instruments; Supplier 1: Digi-Key; Supplier Part Number 1: 296-46275-1-ND; Manufacturer 3: Texas Instruments; Manufacturer Part Number 3: TLV314IDBVR; Supplier 3: LCSC; Supplier Part Number 3: C133032; Manufacturer 2: Texas Instruments; Manufacturer Part Number 2: TLV314IDBVT; Supplier 2: Digi-Key; Supplier Part Number 2: 296-44110-2-ND

## Sheet On_Off.SchDoc: ON / OFF Controller
size A3; DocumentNumber: 3; SheetNumber: 3; SheetTotal: 20
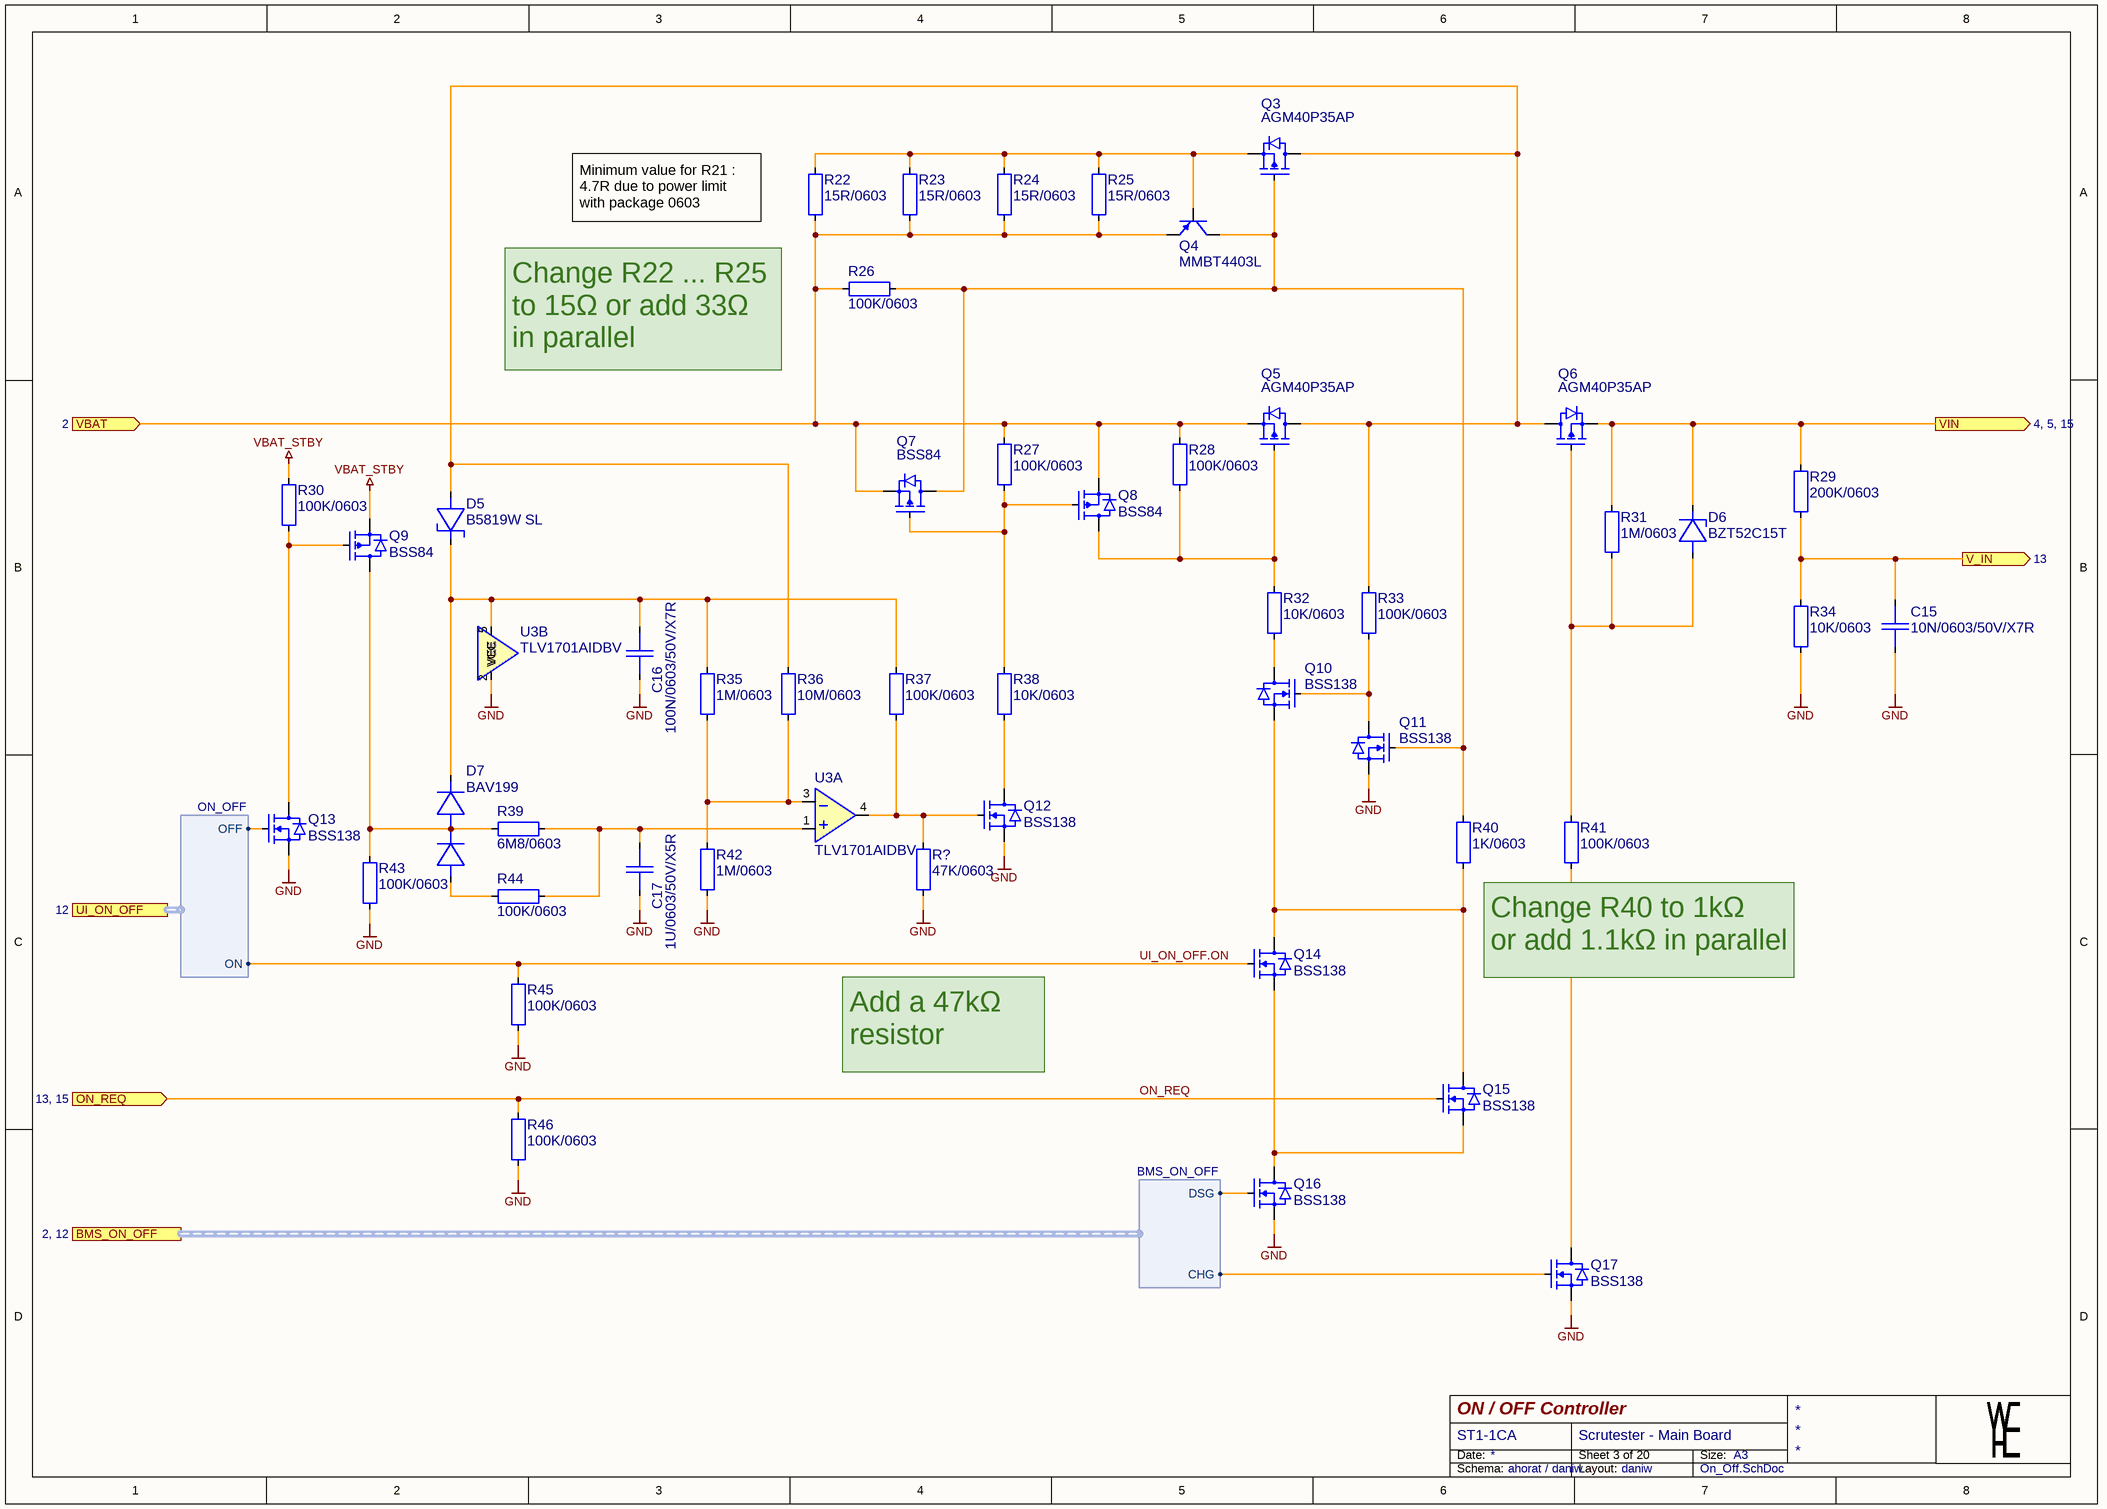
[diagram p5: On_Off.SchDoc]

### Parts
(Parts that share a designator on the sheet are numbered #1, #2 ... from top to bottom, then left to right.)
C15  10N/0603/50V/X7R  [CAP0603_X7R]
C16  100N/0603/50V/X7R  [CAP0603_X7R]
C17  1U/0603/50V/X5R  [CAP0603_X7R]
D5  B5819W SL  [SOD3718X125]
D6  BZT52C15T  [SOD1608X065]
D7  BAV199  [SOT2395P280X125-3-SE]
Q3  AGM40P35AP  [SON065P330X330X075-5-TH245X175]
Q4  MMBT4403L  [SOT2395P280X125-3-SE]
Q5  AGM40P35AP  [SON065P330X330X075-5-TH245X175]
Q6  AGM40P35AP  [SON065P330X330X075-5-TH245X175]
Q7  BSS84  [SOT2395P280X125-3-SE]
Q8  BSS84  [SOT2395P280X125-3-SE]
Q9  BSS84  [SOT2395P280X125-3-SE]
Q10  BSS138  [SOT2395P280X125-3-SE]
Q11  BSS138  [SOT2395P280X125-3-SE]
Q12  BSS138  [SOT2395P280X125-3-SE]
Q13  BSS138  [SOT2395P280X125-3-SE]
Q14  BSS138  [SOT2395P280X125-3-SE]
Q15  BSS138  [SOT2395P280X125-3-SE]
Q16  BSS138  [SOT2395P280X125-3-SE]
Q17  BSS138  [SOT2395P280X125-3-SE]
R22  15R/0603  [R0603-0.40-WW]
R23  15R/0603  [R0603-0.40-WW]
R24  15R/0603  [R0603-0.40-WW]
R25  15R/0603  [R0603-0.40-WW]
R26  100K/0603  [R0603-0.40-WW]
R27  100K/0603  [R0603-0.40-WW]
R28  100K/0603  [R0603-0.40-WW]
R29  200K/0603  [R0603-0.40-WW]
R30  100K/0603  [R0603-0.40-WW]
R31  1M/0603  [R0603-0.40-WW]
R32  10K/0603  [R0603-0.40-WW]
R33  100K/0603  [R0603-0.40-WW]
R34  10K/0603  [R0603-0.40-WW]
R35  1M/0603  [R0603-0.40-WW]
R36  10M/0603  [R0603-0.40-WW]
R37  100K/0603  [R0603-0.40-WW]
R38  10K/0603  [R0603-0.40-WW]
R39  6M8/0603  [R0603-0.40-WW]
R40  1K/0603  [R0603-0.40-WW]
R41  100K/0603  [R0603-0.40-WW]
R42  1M/0603  [R0603-0.40-WW]
R43  100K/0603  [R0603-0.40-WW]
R44  100K/0603  [R0603-0.40-WW]
R45  100K/0603  [R0603-0.40-WW]
R46  100K/0603  [R0603-0.40-WW]
R?#3  47K/0603  [R0603-0.40-WW]
U3  TLV1701AIDBV  [SOT2395P280X125-5-NW]  (parts A,B of 2)

### Ports
BMS_ON_OFF (harness BMS_ON_OFF, see 2, 12), ON_REQ (in, see 13, 15), UI_ON_OFF (harness ON_OFF, see 12), V_IN (out, see 13), VBAT (in, see 2), VIN (out, see 4, 5, 15)

### Harnesses
ON_OFF: OFF, ON
BMS_ON_OFF: CHG, DSG

### Nets
GND: C15.2 C16.2 C17.2 Q11.2(SOURCE) Q12.2(SOURCE) Q13.2(SOURCE) Q16.2(SOURCE) Q17.2(SOURCE) R34.2 R42.2 R43.2 R45.2 R46.2 R?#3.2 U3.2(VEE)
VBAT_STBY: Q9.2(SOURCE) R30.1
BMS_ON_OFF.CHG: Q17.1(GATE) ; port BMS_ON_OFF.CHG
BMS_ON_OFF.DSG: Q16.1(GATE) ; port BMS_ON_OFF.DSG
ON_REQ: Q15.1(GATE) R46.1 ; port ON_REQ
UI_ON_OFF.OFF: Q13.1(GATE) ; port UI_ON_OFF.OFF
UI_ON_OFF.ON: Q14.1(GATE) R45.1 ; port UI_ON_OFF.ON
V_IN: C15.1 R29.2 R34.1 ; port V_IN
VBAT: Q4.2(EMITTER) Q5.1,2,3(SOURCE) Q7.2(SOURCE) Q8.2(SOURCE) R22.1 R23.1 R24.1 R25.1 R26.1 R27.1 R28.1 ; port VBAT
VIN: D6.1(C) Q6.1,2,3(SOURCE) R29.1 R31.1 ; port VIN
NetC16_1: C16.1 D5.1(C) D7.2(K2) R35.1 R37.1 U3.5(VCC)
NetC17_1: C17.1 R39.2 R44.2 U3.1(IN+)
NetD5_2: D5.2(A) Q3.5(DRAIN) Q5.5(DRAIN) Q6.5(DRAIN) R33.1 R36.1
NetD6_2: D6.2(A) Q6.4(GATE) R31.2 R41.1
NetD7_1: D7.1(A1) R44.1
NetD7_3: D7.3(K1/A2) Q9.3(DRAIN) R39.1 R43.1
NetQ3_1,2,3: Q3.1,2,3(SOURCE) Q4.1(BASE) R22.2 R23.2 R24.2 R25.2
NetQ3_4: Q3.4(GATE) Q4.3(COLLECTOR) Q7.3(DRAIN) Q11.1(GATE) R26.2 R40.1
NetQ5_4: Q5.4(GATE) Q8.3(DRAIN) R28.2 R32.1
NetQ7_1: Q7.1(GATE) Q8.1(GATE) R27.2 R38.1
NetQ9_1: Q9.1(GATE) Q13.3(DRAIN) R30.2
NetQ10_1: Q10.1(GATE) Q11.3(DRAIN) R33.2
NetQ10_2: Q10.2(SOURCE) Q14.3(DRAIN) Q15.3(DRAIN) R40.2
NetQ10_3: Q10.3(DRAIN) R32.2
NetQ12_1: Q12.1(GATE) R37.2 R?#3.1 U3.4(OUT)
NetQ12_3: Q12.3(DRAIN) R38.2
NetQ14_2: Q14.2(SOURCE) Q15.2(SOURCE) Q16.3(DRAIN)
NetQ17_3: Q17.3(DRAIN) R41.2
NetR35_2: R35.2 R36.2 R42.1 U3.3(IN-)

### Notes on the sheet
- Minimum value for R21 :
  4.7R due to power limit with package 0603
- Change R22 ... R25 to 15Ω or add 33Ω in parallel
- Change R40 to 1kΩ
  or add 1.1kΩ in parallel
- Add a 47kΩ resistor
- Date:
- Size:
- A3
- Schema:
- Layout:

### Library data of the parts
C15 = 10N/0603/50V/X7R: as C42 on sheet Converter; Part Number: 10N/0603/50V/X7R; Package: 0603; Value: 10nF; HelpURL: https://www.yageo.com/upload/media/product/app/datasheet/mlcc/upy-gphc_x7r_6_3v-to-250v.pdf; Supplier 1: Digi-Key; Supplier Part Number 1: 311-1572-1-ND; Manufacturer 2: YAGEO; Manufacturer Part Number 2: CC0603KRX7R9BB103; Supplier 2: Digi-Key; Supplier Part Number 2: 311-1085-1-ND; Manufacturer Part Number 3: CC0603KRX7R9BB103; Supplier 3: LCSC; Supplier Part Number 3: C100042
C16 = 100N/0603/50V/X7R: as C41 on sheet Converter; Part Number: 100N/0603/50V/X7R; Package: 0603; Value: 100nF; HelpURL: https://www.yageo.com/upload/media/product/app/datasheet/mlcc/upy-gphc_x7r_6_3v-to-250v.pdf; Supplier 1: Digi-Key; Supplier Part Number 1: 311-3567-1-ND; Supplier 3: LCSC; Supplier Part Number 3: C14663; Manufacturer 2: YAGEO; Manufacturer Part Number 2: CC0603MRX7R9BB104; Supplier 2: Digi-Key; Supplier Part Number 2: 311-4110-1-ND; JLC Type: Basic; Manufacturer Part Number 3: CC0603KRX7R9BB104
C17 = 1U/0603/50V/X5R: as C37 on sheet Converter; Part Number: 1U/0603/50V/X5R; Package: 0603; Value: 1.0uF; HelpURL: https://mm.digikey.com/Volume0/opasdata/d220001/medias/docus/658/CL10A105KB8NNNC_Spec.pdf; Supplier 1: Digi-Key; Supplier Part Number 1: 1276-1860-1-ND; Manufacturer Part Number 3: CL10A105KB8NNNC; Supplier 3: LCSC; Supplier Part Number 3: C15849; JLC Type: Basic
D5 = B5819W SL: as D34 on sheet User_Interface; Part Number: B5819W SL; Package: SOD-123; Value: B5819W SL; Absolute Value: 40V; HelpURL: https://datasheet.lcsc.com/lcsc/2304140030_Jiangsu-Changjing-Electronics-Technology-Co---Ltd--B5819W-SL_C8598.pdf; Manufacturer 3: Jiangsu Changjing Electronics Technology Co., Ltd.; Manufacturer Part Number 3: B5819W SL; Supplier 3: LCSC; Supplier Part Number 3: C8598; JLC Type: Basic; Manufacturer Part Number 1: B5819WSL; Supplier 1: Digikey; Supplier Part Number 1: 1655-B5819WSLCT-ND
D6 = BZT52C15T: DIODE ZENER 15V 100MW SOD523; Manufacturer: Micro Commercial Co; Manufacturer Part Number 1: BZT52C15T-TP; Part Number: BZT52C15T; Package: SC-79, SOD-523; Value: BZT52C15T; Absolute Value: 15 V; HelpURL: https://www.mccsemi.com/pdf/Products/BZT52C(B)2V4T-BZT52C(B)39T(SOD-523).pdf; Manufacturer 1: Micro Commercial Co; Supplier 1: Digikey; Supplier Part Number 1: BZT52C15T-TPMSCT-ND; Manufacturer 2: Diodes Incorporated; Manufacturer Part Number 2: BZT52C15T-7; Supplier 2: Digikey; Supplier Part Number 2: BZT52C15T-7DICT-ND; Manufacturer 3: Diodes Incorporated; Manufacturer Part Number 3: BZT52C15T-7; Supplier 3: LCSC; Supplier Part Number 3: C460787
D7 = BAV199: Silicon Low Leakage Diode 85V; Manufacturer: Infineon Technologies; Manufacturer Part Number 1: BAV199E6433HTMA1; Part Number: BAV199; Package: SOT23; Value: BAV199; Absolute Value: 85V; HelpURL: https://www.infineon.com/dgdl/bav199series.pdf?folderId=db3a30431400ef6801141c748874044e&fileId=db3a30431400ef6801141cba733104e5; Manufacturer 1: Infineon Technologies; Supplier 1: Digikey; Supplier Part Number 1: BAV199E6433HTMA1CT-ND; Manufacturer 3: LRC; Manufacturer Part Number 3: LBAV199LT1G; Supplier 3: LCSC; Supplier Part Number 3: C12740
Q3 Q5 Q6 = AGM40P35AP: 40V 35A 11mΩ@10V,15A 30W 1.7V 1 piece P-channel PDFN(3.3x3.3) MOSFETs ROHS; Manufacturer: AGM-Semi; Part Number: AGM40P35AP; Package: 8-PowerVDFN; HelpURL: https://www.lcsc.com/datasheet/lcsc_datasheet_2504101957_AGM-Semi-AGM40P35AP_C18221399.pdf; Manufacturer 3: AGM-Semi; Manufacturer Part Number 3: AGM40P35AP; Supplier 3: LCSC; Supplier Part Number 3: C18221399
Q4 = MMBT4403L: Switching Transistor PNP Silicon; Manufacturer: ON SEMI; Part Number: MMBT4403L; Package: SOT23; HelpURL: https://www.onsemi.com/pdf/datasheet/mmbt4403lt1-d.pdf; Manufacturer 3: ONSEMI; Manufacturer Part Number 3: MMBT4403LT1G; Supplier 3: LCSC; Supplier Part Number 3: C78864; JLC Type: Extended
Q7-Q9 = BSS84: as Q34 on sheet User_Interface; Part Number: BSS84; Package: SOT23; HelpURL: https://goodarksemi.com/docs/datasheets/mosfets/BSS84.pdf; Manufacturer Part Number 1: BSS84; Supplier 1: Digi-Key; Supplier Part Number 1: 4786-BSS84CT-ND; Manufacturer 3: Jiangsu Changjing Electronics Technology Co., Ltd.; Manufacturer Part Number 3: BSS84; Supplier 3: LCSC; Supplier Part Number 3: C114481; JLC Type: Extended; Manufacturer 2: LRC; Manufacturer Part Number 2: LBSS84LT1G; Supplier 2: LCSC; Supplier Part Number 2: C8492
Q10-Q17 = BSS138: as Q36 on sheet User_Interface; Part Number: BSS138; Package: SOT23; HelpURL: https://mm.digikey.com/Volume0/opasdata/d220001/medias/docus/3037/BSS138.pdf; Manufacturer Part Number 1: BSS138; Supplier 1: Digi-Key; Supplier Part Number 1: 4530-BSS138CT-ND; Manufacturer 3: FOSAN; Manufacturer Part Number 3: BSS138; Supplier 3: LCSC; Supplier Part Number 3: C2926186; JLC Type: Extended; Manufacturer 2: FOSAN; Manufacturer Part Number 2: BSS138; Supplier 2: LCSC; Supplier Part Number 2: C2926186
R22-R25 = 15R/0603: RES SM 0603 15R; Manufacturer: GENERIC; Manufacturer 1: YAGEO; Manufacturer Part Number 1: RC0603FR-1315RL; Absolute Value: 15; Eurocircuits GPN: GPR060315R; Part Number: 15R/0603; Package: 0603; Value: 15R; HelpURL: https://www.yageogroup.com/content/datasheet/asset/file/PYU-RC_GROUP_51_ROHS_L; Supplier 1: Digi-Key; Supplier Part Number 1: 13-RC0603FR-1315RLCT-ND; Manufacturer 2: YAGEO; Manufacturer Part Number 2: RC0603FR-1015RL; Supplier 2: Digi-Key; Supplier Part Number 2: 13-RC0603FR-1015RLCT-ND
R26-R28 R30 R33 R37 R41 R43-R46 = 100K/0603: as R229 on sheet User_Interface; Part Number: 100K/0603; Package: 0603; Value: 100K; HelpURL: https://www.yageogroup.com/content/datasheet/asset/file/PYU-RC_GROUP_51_ROHS_L; Supplier 1: Digi-Key; Supplier Part Number 1: 13-RC0603FR-13100KLCT-ND; Manufacturer 2: YAGEO; Manufacturer Part Number 2: RC0603FR-10100KL; Supplier 2: Digi-Key; Supplier Part Number 2: 13-RC0603FR-10100KLCT-ND; Manufacturer 3: UNI-ROYAL(Uniroyal Elec); Manufacturer Part Number 3: 0603WAF1003T5E; Supplier 3: LCSC; Supplier Part Number 3: C25803; JLC Type: Basic
R29 = 200K/0603: RES SM 0603 200K; Manufacturer: GENERIC; Manufacturer 1: YAGEO; Manufacturer Part Number 1: RC0603FR-13200KL; Absolute Value: 200000; Eurocircuits GPN: GPR0603200K; Part Number: 200K/0603; Package: 0603; Value: 200K; HelpURL: https://www.yageogroup.com/content/datasheet/asset/file/PYU-RC_GROUP_51_ROHS_L; Supplier 1: Digi-Key; Supplier Part Number 1: 13-RC0603FR-13200KLCT-ND; Manufacturer 2: YAGEO; Manufacturer Part Number 2: RC0603FR-10200KL; Supplier 2: Digi-Key; Supplier Part Number 2: 13-RC0603FR-10200KLCT-ND; JLC Type: Basic; Manufacturer 3: UNI-ROYAL(Uniroyal Elec); Manufacturer Part Number 3: 0603WAF2003T5E; Supplier 3: LCSC; Supplier Part Number 3: C25811
R31 R35 R42 = 1M/0603: as R203 on sheet User_Interface; Part Number: 1M/0603; Package: 0603; Value: 1M; HelpURL: https://www.yageogroup.com/content/datasheet/asset/file/PYU-RC_GROUP_51_ROHS_L; Supplier 1: Digi-Key; Supplier Part Number 1: 13-RC0603FR-131MLCT-ND; Manufacturer 2: YAGEO; Manufacturer Part Number 2: RC0603FR-101ML; Supplier 2: Digi-Key; Supplier Part Number 2: 13-RC0603FR-101MLCT-ND; Manufacturer 3: UNI-ROYAL(Uniroyal Elec); Manufacturer Part Number 3: 0603WAF1004T5E; Supplier 3: LCSC; Supplier Part Number 3: C22935; JLC Type: Basic
R32 R34 R38 = 10K/0603: as R217 on sheet User_Interface; Part Number: 10K/0603; Package: 0603; Value: 10K; HelpURL: https://www.yageogroup.com/content/datasheet/asset/file/PYU-RC_GROUP_51_ROHS_L; Supplier 1: Digi-Key; Supplier Part Number 1: 13-RC0603FR-1310KLCT-ND; Manufacturer 2: YAGEO; Manufacturer Part Number 2: RC0603FR-1010KL; Supplier 2: Digi-Key; Supplier Part Number 2: 13-RC0603FR-1010KLCT-ND; Manufacturer 3: UNI-ROYAL(Uniroyal Elec); Manufacturer Part Number 3: 0603WAF1002T5E; Supplier 3: LCSC; Supplier Part Number 3: C25804; JLC Type: Basic
R36 = 10M/0603: RES SM 0603 10M; Manufacturer: GENERIC; Manufacturer 1: YAGEO; Manufacturer Part Number 1: RC0603FR-1310ML; Absolute Value: 10000000; Eurocircuits GPN: GPR060310M; Part Number: 10M/0603; Package: 0603; Value: 10M; HelpURL: https://www.yageogroup.com/content/datasheet/asset/file/PYU-RC_GROUP_51_ROHS_L; Supplier 1: Digi-Key; Supplier Part Number 1: 13-RC0603FR-1310MLCT-ND; Manufacturer 2: YAGEO; Manufacturer Part Number 2: RC0603FR-1010ML; Supplier 2: Digi-Key; Supplier Part Number 2: 13-RC0603FR-1010MLCT-ND; Manufacturer 3: UNI-ROYAL(Uniroyal Elec); Manufacturer Part Number 3: 0603WAF1005T5E; Supplier 3: LCSC; Supplier Part Number 3: C7250; JLC Type: Basic
R39 = 6M8/0603: RES SM 0603 6M8; Manufacturer: GENERIC; Manufacturer 1: YAGEO; Manufacturer Part Number 1: RC0603FR-076M8L; Absolute Value: 6800000; Eurocircuits GPN: GPR06036M8; Part Number: 6M8/0603; Package: 0603; Value: 6M8; HelpURL: https://www.yageogroup.com/content/datasheet/asset/file/PYU-RC_GROUP_51_ROHS_L; Supplier 1: Digi-Key; Supplier Part Number 1: 13-RC0603FR-076M8LCT-ND; JLC Type: Extended; Manufacturer 3: FOJAN; Manufacturer Part Number 3: FRC0603F6804TS; Supplier 3: LCSC; Supplier Part Number 3: C3013205
R40 = 1K/0603: RES SM 0603 1K; Manufacturer: GENERIC; Manufacturer 1: YAGEO; Manufacturer Part Number 1: RC0603FR-131KL; Absolute Value: 1000; Eurocircuits GPN: GPR06031K; Part Number: 1K/0603; Package: 0603; Value: 1K; HelpURL: https://www.yageogroup.com/content/datasheet/asset/file/PYU-RC_GROUP_51_ROHS_L; Supplier 1: Digi-Key; Supplier Part Number 1: 13-RC0603FR-131KLCT-ND; Manufacturer 2: YAGEO; Manufacturer Part Number 2: RC0603FR-101KL; Supplier 2: Digi-Key; Supplier Part Number 2: 13-RC0603FR-101KLCT-ND; Manufacturer 3: UNI-ROYAL(Uniroyal Elec); Manufacturer Part Number 3: 0603WAF1001T5E; Supplier 3: LCSC; Supplier Part Number 3: C21190; JLC Type: Basic
R?#3 = 47K/0603: RES SM 0603 47K; Manufacturer: GENERIC; Manufacturer 1: YAGEO; Manufacturer Part Number 1: RC0603FR-1347KL; Absolute Value: 47000; Eurocircuits GPN: GPR060347K; Part Number: 47K/0603; Package: 0603; Value: 47K; HelpURL: https://www.yageogroup.com/content/datasheet/asset/file/PYU-RC_GROUP_51_ROHS_L; Supplier 1: Digi-Key; Supplier Part Number 1: 13-RC0603FR-1347KLCT-ND; Manufacturer 2: YAGEO; Manufacturer Part Number 2: RC0603FR-1047KL; Supplier 2: Digi-Key; Supplier Part Number 2: 13-RC0603FR-1047KLCT-ND; Manufacturer 3: UNI-ROYAL(Uniroyal Elec); Manufacturer Part Number 3: 0603WAF4702T5E; Supplier 3: LCSC; Supplier Part Number 3: C25819; JLC Type: Basic
U3 = TLV1701 SOT23: TLV1701 2.2-V to 36-V, microPower Comparato; Manufacturer: Texas Instruments; Manufacturer Part Number 1: TLV1701AIDBVR; Part Number: TLV1701 SOT23; Package: SOT23-5; HelpURL: https://www.ti.com/lit/ds/symlink/tlv1701.pdf; Manufacturer 1: Texas Instruments; Supplier 1: Digi-Key; Supplier Part Number 1: 296-40599-1-ND; Manufacturer 3: Texas Instruments; Manufacturer Part Number 3: TLV1701AIDBVR; Supplier 3: LCSC; Supplier Part Number 3: C130035; Manufacturer 2: Texas Instruments; Manufacturer Part Number 2: TLV1701QDBVRQ1; Supplier 2: Digi-Key; Supplier Part Number 2: 296-47458-1-ND